# EAGLE schematic My-Stomp_1_1 (EAGLE 6.5.0)
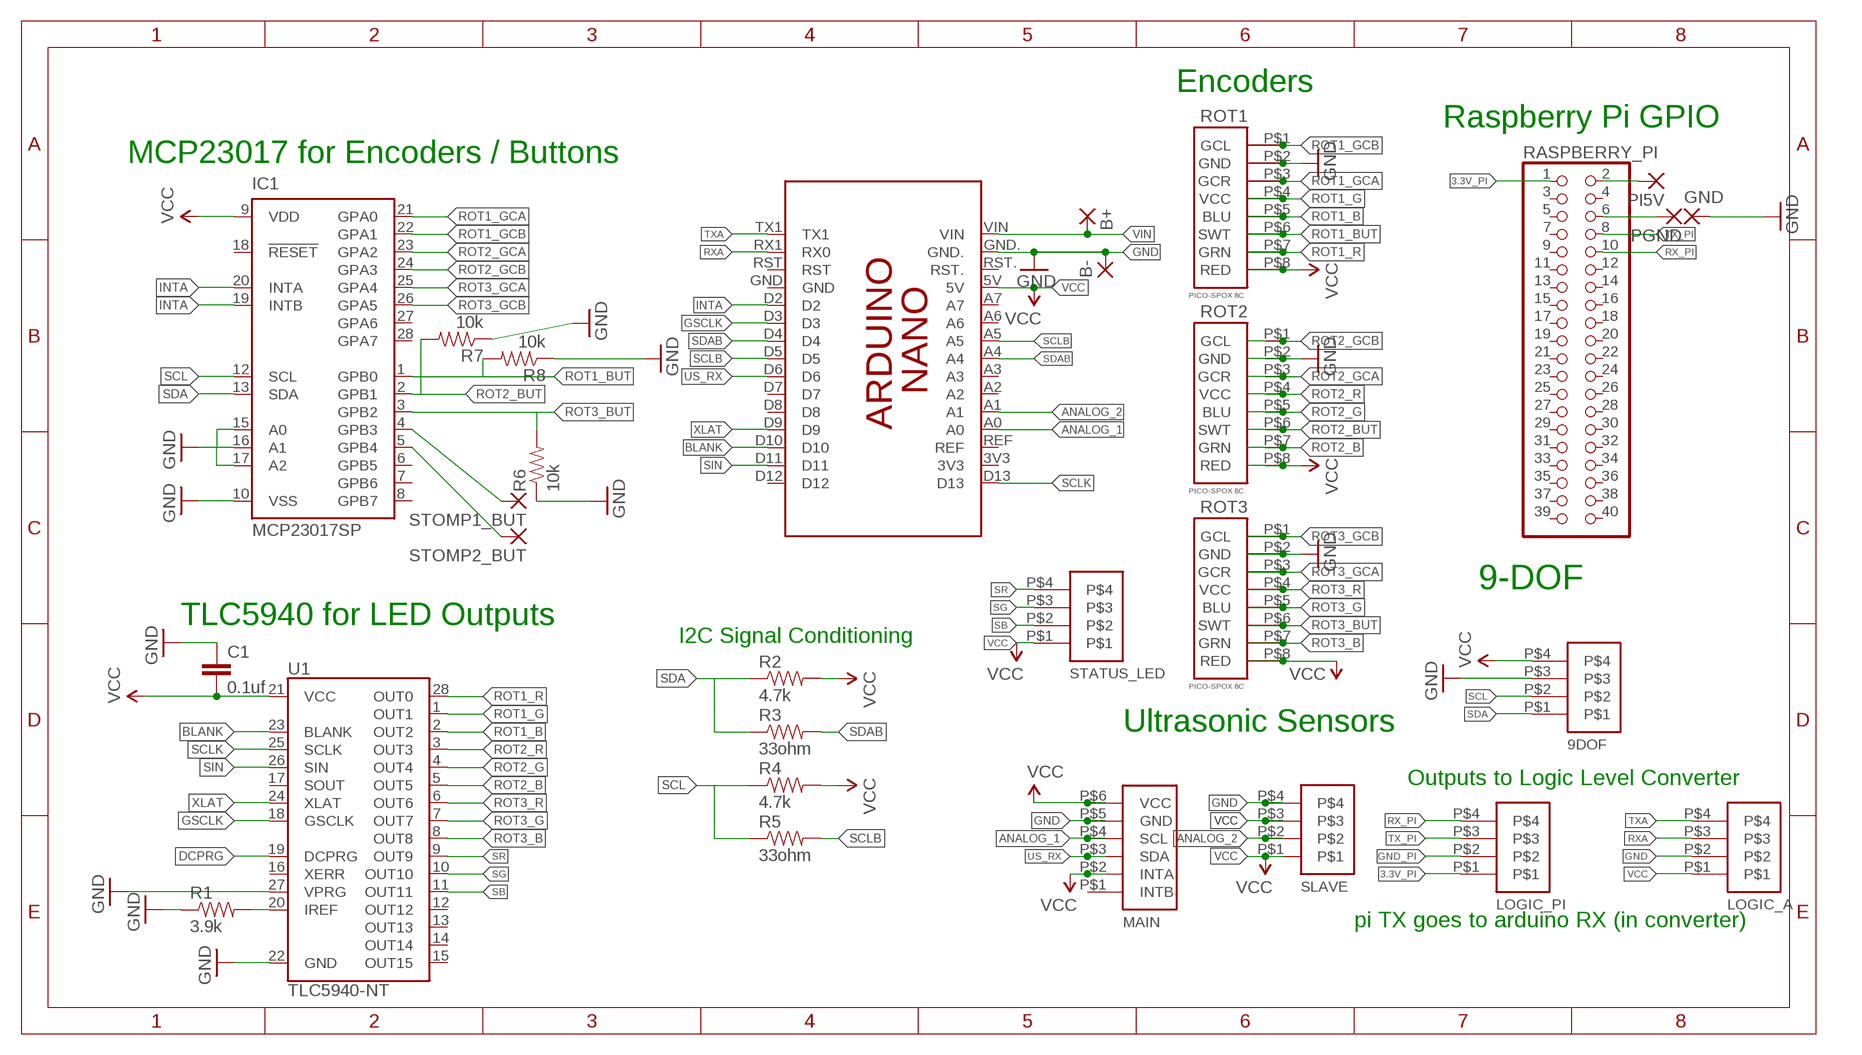
[diagram p0: schematic, sheet 1]

## Parts
9DOF  PICO_SPOX_4C  [PICO_SPOX_4C]
B+  2,15/1,0  [2,15/1,0]
B-  2,15/1,0  [2,15/1,0]
C1  0.1uf  CAPPTH1  [CAP-PTH-5MM]
GND  2,15/1,0  [2,15/1,0]
IC1  MCP23017SP  [DIL28-3]
LOGIC_A  PICO_SPOX_4C  [PICO_SPOX_4C]
LOGIC_PI  PICO_SPOX_4C  [PICO_SPOX_4C]
MAIN  PICO_SPOX_6C  [PICO_SPOX_6C]
PCB2  ARDUINO_NANO  [ARDUINO_NANO]
PGND  2,15/1,0  [2,15/1,0]
PI5V  2,15/1,0  [2,15/1,0]
R1  3.9k  RESISTORPTH1  [AXIAL-0.3]
R2  4.7k  RESISTORPTH1  [AXIAL-0.3]
R3  33ohm  RESISTORPTH1  [AXIAL-0.3]
R4  4.7k  RESISTORPTH1  [AXIAL-0.3]
R5  33ohm  RESISTORPTH1  [AXIAL-0.3]
R6  10k  RESISTORPTH1  [AXIAL-0.3]
R7  10k  RESISTORPTH1  [AXIAL-0.3]
R8  10k  RESISTORPTH1  [AXIAL-0.3]
RASPBERRY_PI  PINHD-2X20  [2X20]
ROT1  PICO_SPOX_8C  [PICO_SPOC_8C]
ROT2  PICO_SPOX_8C  [PICO_SPOC_8C]
ROT3  PICO_SPOX_8C  [PICO_SPOC_8C]
SLAVE  PICO_SPOX_4C  [PICO_SPOX_4C]
STATUS_LED  PICO_SPOX_4C  [PICO_SPOX_4C]
STOMP1_BUT  2,15/1,0  [2,15/1,0]
STOMP2_BUT  2,15/1,0  [2,15/1,0]
U1  TLC5940-NT  [DIL28-3]

## Nets
3.3V_PI: LOGIC_PI.P$1 RASPBERRY_PI.1
ANALOG_1: MAIN.P$4(SCL) PCB2.A0
ANALOG_2: PCB2.A1 SLAVE.P$2
BLANK: PCB2.D10 U1.23(BLANK)
DCPRG: U1.19(DCPRG)
GND: 9DOF.P$3 B-.1(P) C1.1 GND.1(P) IC1.10(VSS) IC1.15(A0) IC1.16(A1) IC1.17(A2) LOGIC_A.P$2 MAIN.P$5(GND) PCB2.GND. R1.P$1 R6.P$1 R7.P$1 R8.P$1 ROT1.P$2(GND) ROT2.P$2(GND) ROT3.P$2(GND) SLAVE.P$4 U1.22(GND) U1.27(VPRG)
GND_PI: LOGIC_PI.P$2 PGND.1(P) RASPBERRY_PI.6
GSCLK: PCB2.D3 U1.18(GSCLK)
INTA: IC1.19(INTB) IC1.20(INTA) PCB2.D2
N$2: IC1.4(GPB3) STOMP1_BUT.1(P)
N$3: IC1.5(GPB4) STOMP2_BUT.1(P)
N$5: PI5V.1(P) RASPBERRY_PI.2
N$20: R1.P$2 U1.20(IREF)
ROT1_B: ROT1.P$5(BLU) U1.2(OUT2)
ROT1_BUT: IC1.1(GPB0) R8.P$2 ROT1.P$6(SWT)
ROT1_G: ROT1.P$4(VCC) U1.1(OUT1)
ROT1_GCA: IC1.21(GPA0) ROT1.P$3(GCR)
ROT1_GCB: IC1.22(GPA1) ROT1.P$1(GCL)
ROT1_R: ROT1.P$7(GRN) U1.28(OUT0)
ROT2_B: ROT2.P$7(GRN) U1.5(OUT5)
ROT2_BUT: IC1.2(GPB1) R7.P$2 ROT2.P$6(SWT)
ROT2_G: ROT2.P$5(BLU) U1.4(OUT4)
ROT2_GCA: IC1.23(GPA2) ROT2.P$3(GCR)
ROT2_GCB: IC1.24(GPA3) ROT2.P$1(GCL)
ROT2_R: ROT2.P$4(VCC) U1.3(OUT3)
ROT3_B: ROT3.P$7(GRN) U1.8(OUT8)
ROT3_BUT: IC1.3(GPB2) R6.P$2 ROT3.P$6(SWT)
ROT3_G: ROT3.P$5(BLU) U1.7(OUT7)
ROT3_GCA: IC1.25(GPA4) ROT3.P$3(GCR)
ROT3_GCB: IC1.26(GPA5) ROT3.P$1(GCL)
ROT3_R: ROT3.P$4(VCC) U1.6(OUT6)
RX_PI: LOGIC_PI.P$4 RASPBERRY_PI.10
RXA: LOGIC_A.P$3 PCB2.RX1(RX0)
SB: STATUS_LED.P$2 U1.11(OUT11)
SCL: 9DOF.P$2 IC1.12(SCL) R4.P$1 R5.P$1
SCLB: PCB2.A5 PCB2.D5 R5.P$2
SCLK: PCB2.D13 U1.25(SCLK)
SDA: 9DOF.P$1 IC1.13(SDA) R2.P$1 R3.P$1
SDAB: PCB2.A4 PCB2.D4 R3.P$2
SG: STATUS_LED.P$3 U1.10(OUT10)
SIN: PCB2.D11 U1.26(SIN)
SR: STATUS_LED.P$4 U1.9(OUT9)
TX_PI: LOGIC_PI.P$3 RASPBERRY_PI.8
TXA: LOGIC_A.P$4 PCB2.TX1
US_RX: MAIN.P$3(SDA) PCB2.D6
VCC [VCC]: 9DOF.P$4 C1.2 IC1.9(VDD) LOGIC_A.P$1 MAIN.P$2(INTA) MAIN.P$6(VCC) PCB2.5V R2.P$2 R4.P$2 ROT1.P$8(RED) ROT2.P$8(RED) ROT3.P$8(RED) SLAVE.P$1 SLAVE.P$3 STATUS_LED.P$1 U1.21(VCC)
VIN: B+.1(P) PCB2.VIN
XLAT: PCB2.D9 U1.24(XLAT)
Unconnected: IC1.6(GPB5) IC1.7(GPB6) IC1.8(GPB7) IC1.18(!RESET) IC1.27(GPA6) IC1.28(GPA7) MAIN.P$1(INTB) PCB2.3V3 PCB2.A2 PCB2.A3 PCB2.A6 PCB2.A7 PCB2.D7 PCB2.D8 PCB2.D12 PCB2.GND PCB2.REF PCB2.RST PCB2.RST. RASPBERRY_PI.3 RASPBERRY_PI.4 RASPBERRY_PI.5 RASPBERRY_PI.7 RASPBERRY_PI.9 RASPBERRY_PI.11 RASPBERRY_PI.12 RASPBERRY_PI.13 RASPBERRY_PI.14 RASPBERRY_PI.15 RASPBERRY_PI.16 RASPBERRY_PI.17 RASPBERRY_PI.18 RASPBERRY_PI.19 RASPBERRY_PI.20 RASPBERRY_PI.21 RASPBERRY_PI.22 RASPBERRY_PI.23 RASPBERRY_PI.24 RASPBERRY_PI.25 RASPBERRY_PI.26 RASPBERRY_PI.27 RASPBERRY_PI.28 RASPBERRY_PI.29 RASPBERRY_PI.30 RASPBERRY_PI.31 RASPBERRY_PI.32 RASPBERRY_PI.33 RASPBERRY_PI.34 RASPBERRY_PI.35 RASPBERRY_PI.36 RASPBERRY_PI.37 RASPBERRY_PI.38 RASPBERRY_PI.39 RASPBERRY_PI.40 U1.12(OUT12) U1.13(OUT13) U1.14(OUT14) U1.15(OUT15) U1.16(XERR) U1.17(SOUT)

## Notes on the sheet
- Encoders
- Raspberry Pi GPIO
- MCP23017 for Encoders / Buttons
- 9-DOF
- TLC5940 for LED Outputs
- I2C Signal Conditioning
- Ultrasonic Sensors
- Outputs to Logic Level Converter
- pi TX goes to arduino RX (in converter)

## Library data of the parts
9DOF LOGIC_A LOGIC_PI SLAVE STATUS_LED = Mollex_Pico_Spox:PICO_SPOX_4C
B+ B- GND PGND PI5V STOMP1_BUT STOMP2_BUT = wirepad:2,15/1,0: THROUGH-HOLE PAD
C1 = SparkFun-Passives:CAP: Capacitor Standard 0603 ceramic capacitor, and 0.1" leaded capacitor.
IC1 = adafruit:MCP23017: http://ww1.microchip.com/downloads/en/DeviceDoc/21952a.pdf Source: http://ww1.microchip.com/downloads/en/DeviceDoc/21952a.pdf
MAIN = Mollex_Pico_Spox:PICO_SPOX_6C
PCB2 = E14_Arduino_published:ARDUINO_NANO: Device for representing an Arduino Nano board with a footprint in an EAGLE design. Created by Dave Young for Element14. More EAGLE documentation at: http://www.element14.com/community/community/knode/cadsoft_eagle
R1-R8 = SparkFun:RESISTOR: Resistor Basic schematic elements and footprints for 0603, 1206, and PTH 1/10th watt (small) resistors.
RASPBERRY_PI = raspberry_pi:PINHD-2X20: PIN HEADER
ROT1-ROT3 = Mollex_Pico_Spox:PICO_SPOX_8C
U1 = SparkFun-DigitalIC:TLC5940: 16-channel LED Driver with Dot Correction and Grayscale PWM Control The TLC5940 is a 16-channel, constant-current sink LED driver. Each channel has an individually adjustable 4096-step grayscale PWM brightness control and a 64-step, constant-current sink (dot correction). The dot correction adjusts the brightness variations between LED channels and other LED drivers. The dot correction data is stored in an integrated EEPROM. Both grayscale control and dot correction are accessible via a serial interface. A single external resistor sets the maximum current value of all 16 channels. Packages: 28-pin HTSSOP 32-pin 5x5mm QFN 28-pin DIP

## Net classes
0 default: width 0.254 mm, drill 0.33 mm, clearance 0.229 mm
1 VCC: width 0.635 mm, drill 0.381 mm, clearance 0.33 mm